# Altium schematic sheet Main_NTC_Extension_5fach.SchDoc: Sheetname
size A4; Date: 05.10.2017; CheckedBy: UNCHECKED; Author: Team Member; Organization: Baltic Racing; Address1: Zur Schwedenschanze 15; Address2: Haus 18; Address3: 18435 Stralsund; Revision: xx.xx; SheetNumber: 1; SheetTotal: 1; Rules: TODO; ProjectName: Projekt
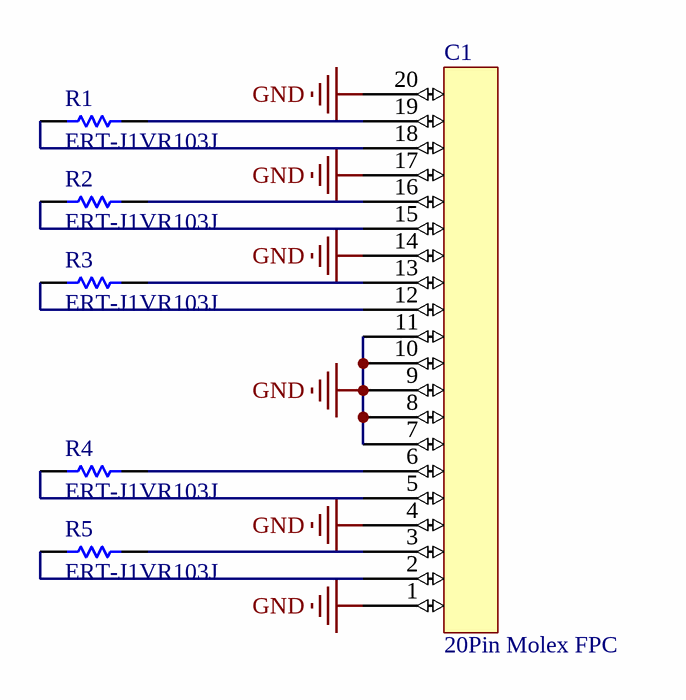
[diagram p0: Main_NTC_Extension_5fach.SchDoc]

## Parts
C1  20Pin Molex FPC  [Molex 20 Pin FPC]
R1  ERT-J1VR103J  [RESC1608X90X30ML15T20]
R2  ERT-J1VR103J  [RESC1608X90X30ML15T20]
R3  ERT-J1VR103J  [RESC1608X90X30ML15T20]
R4  ERT-J1VR103J  [RESC1608X90X30ML15T20]
R5  ERT-J1VR103J  [RESC1608X90X30ML15T20]

## Nets
GND: C1.1 C1.4 C1.7 C1.8 C1.9 C1.10 C1.11 C1.14 C1.17 C1.20
NetC1_2: C1.2 R5.1
NetC1_3: C1.3 R5.2
NetC1_5: C1.5 R4.1
NetC1_6: C1.6 R4.2
NetC1_12: C1.12 R3.1
NetC1_13: C1.13 R3.2
NetC1_15: C1.15 R2.1
NetC1_16: C1.16 R2.2
NetC1_18: C1.18 R1.1
NetC1_19: C1.19 R1.2

## Notes on the sheet
- Title:
- Projekt:
- Revision:
- Author:
- Rules:
- Checked by:
- Sheet
- of
- Size:
- A4
- Date:
- Time:

## Library data of the parts
C1 = 20Pin Molex FPC: Flex PCB part for the Molex 20pin FCC
R1-R5 = CMP-2000-00869-1: Manufacturer: Panasonic; Part Number: ERT-J1VR103J